# Altium schematic sheet m20048 GPS.SchDoc
size A
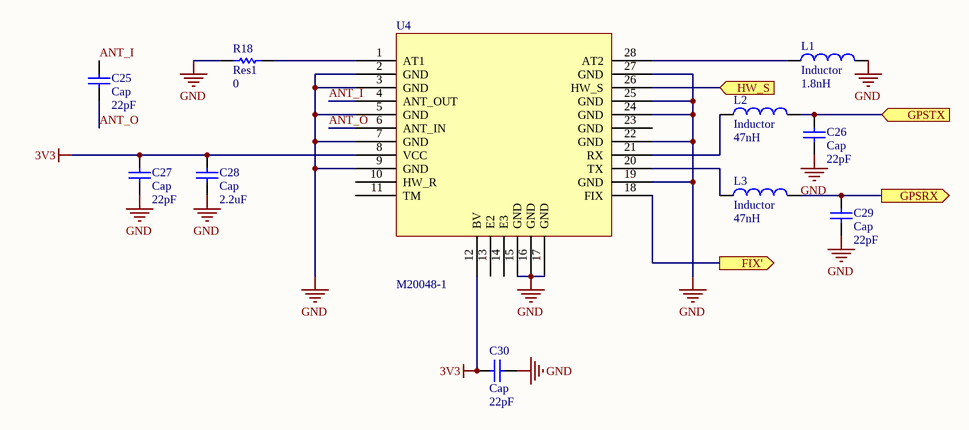
[diagram p0: m20048 GPS.SchDoc]

## Parts
C25  Cap  value 22pF  [0402-A]
C26  Cap  value 22pF  [0402-A]
C27  Cap  value 22pF  [0402-A]
C28  Cap  value 2.2uF  [0402-A]
C29  Cap  value 22pF  [0402-A]
C30  Cap  value 22pF  [0402-A]
L1  Inductor  value 1.8nH  [0402-A]
L2  Inductor  value 47nH  [0402-A]
L3  Inductor  value 47nH  [0402-A]
R18  Res1  value 0  [0402-A]
U4  M20048-1  [M20048-1]

## Ports
FIX' (out), GPSRX (out), GPSTX (in), HW_S (in)

## Nets
3V3: C27.2 C28.2 C30.2 U4.8(VCC) U4.12(BV)
GND: C26.1 C27.1 C28.1 C29.1 C30.1 L1.2 R18.1 U4.2(GND) U4.3(GND) U4.5(GND) U4.7(GND) U4.9(GND) U4.15(GND) U4.16(GND) U4.17(GND) U4.19(GND) U4.22(GND) U4.24(GND) U4.25(GND) U4.27(GND)
ANT_I: C25.2 U4.4(ANT_OUT)
ANT_O: C25.1 U4.6(ANT_IN)
FIX': U4.18(FIX) ; port FIX'
GPSRX: C29.2 L3.2 ; port GPSRX
GPSTX: C26.2 L2.2 ; port GPSTX
HW_S: U4.26(HW_S) ; port HW_S
NetL1_1: L1.1 U4.28(AT2)
NetL2_1: L2.1 U4.21(RX)
NetL3_1: L3.1 U4.20(TX)
NetR18_2: R18.2 U4.1(AT1)

Not connected (* = marked no-connect by the designer): U4 10(HW_R) 11(TM) 13(E2) 14(E3) 23(GND)

## Library data of the parts
C25-C30 = Cap: Capacitor; Published: 8-Jun-2000; LatestRevisionDate: 17-Jul-2002; LatestRevisionNote: Re-released for DXP Platform.; PackageReference: RAD-0.3; Publisher: Altium Limited; PackageDescription: Radial Cap, Thru-Hole; 2 Leads; 0.3 in Pin Spacing
L1-L3 = Inductor: Code_IEC: 1005; Published: 8-Jun-2000; LatestRevisionDate: 29-May-2009; LatestRevisionNote: IPC-7351 Footprint Added.; PackageReference: 0402-A; Publisher: Altium Limited; PackageDescription: Chip Inductor; Code_JEITA: 0402
R18 = Res1: Resistor; Published: 8-Jun-2000; LatestRevisionDate: 17-Jul-2002; LatestRevisionNote: Re-released for DXP Platform.; PackageReference: AXIAL-0.3; Publisher: Altium Limited; PackageDescription: Axial Device, Thru-Hole; 2 Leads; 0.3 in Pin Spacing